# EAGLE design MotoraufsatzschSMD (EAGLE 4.16)
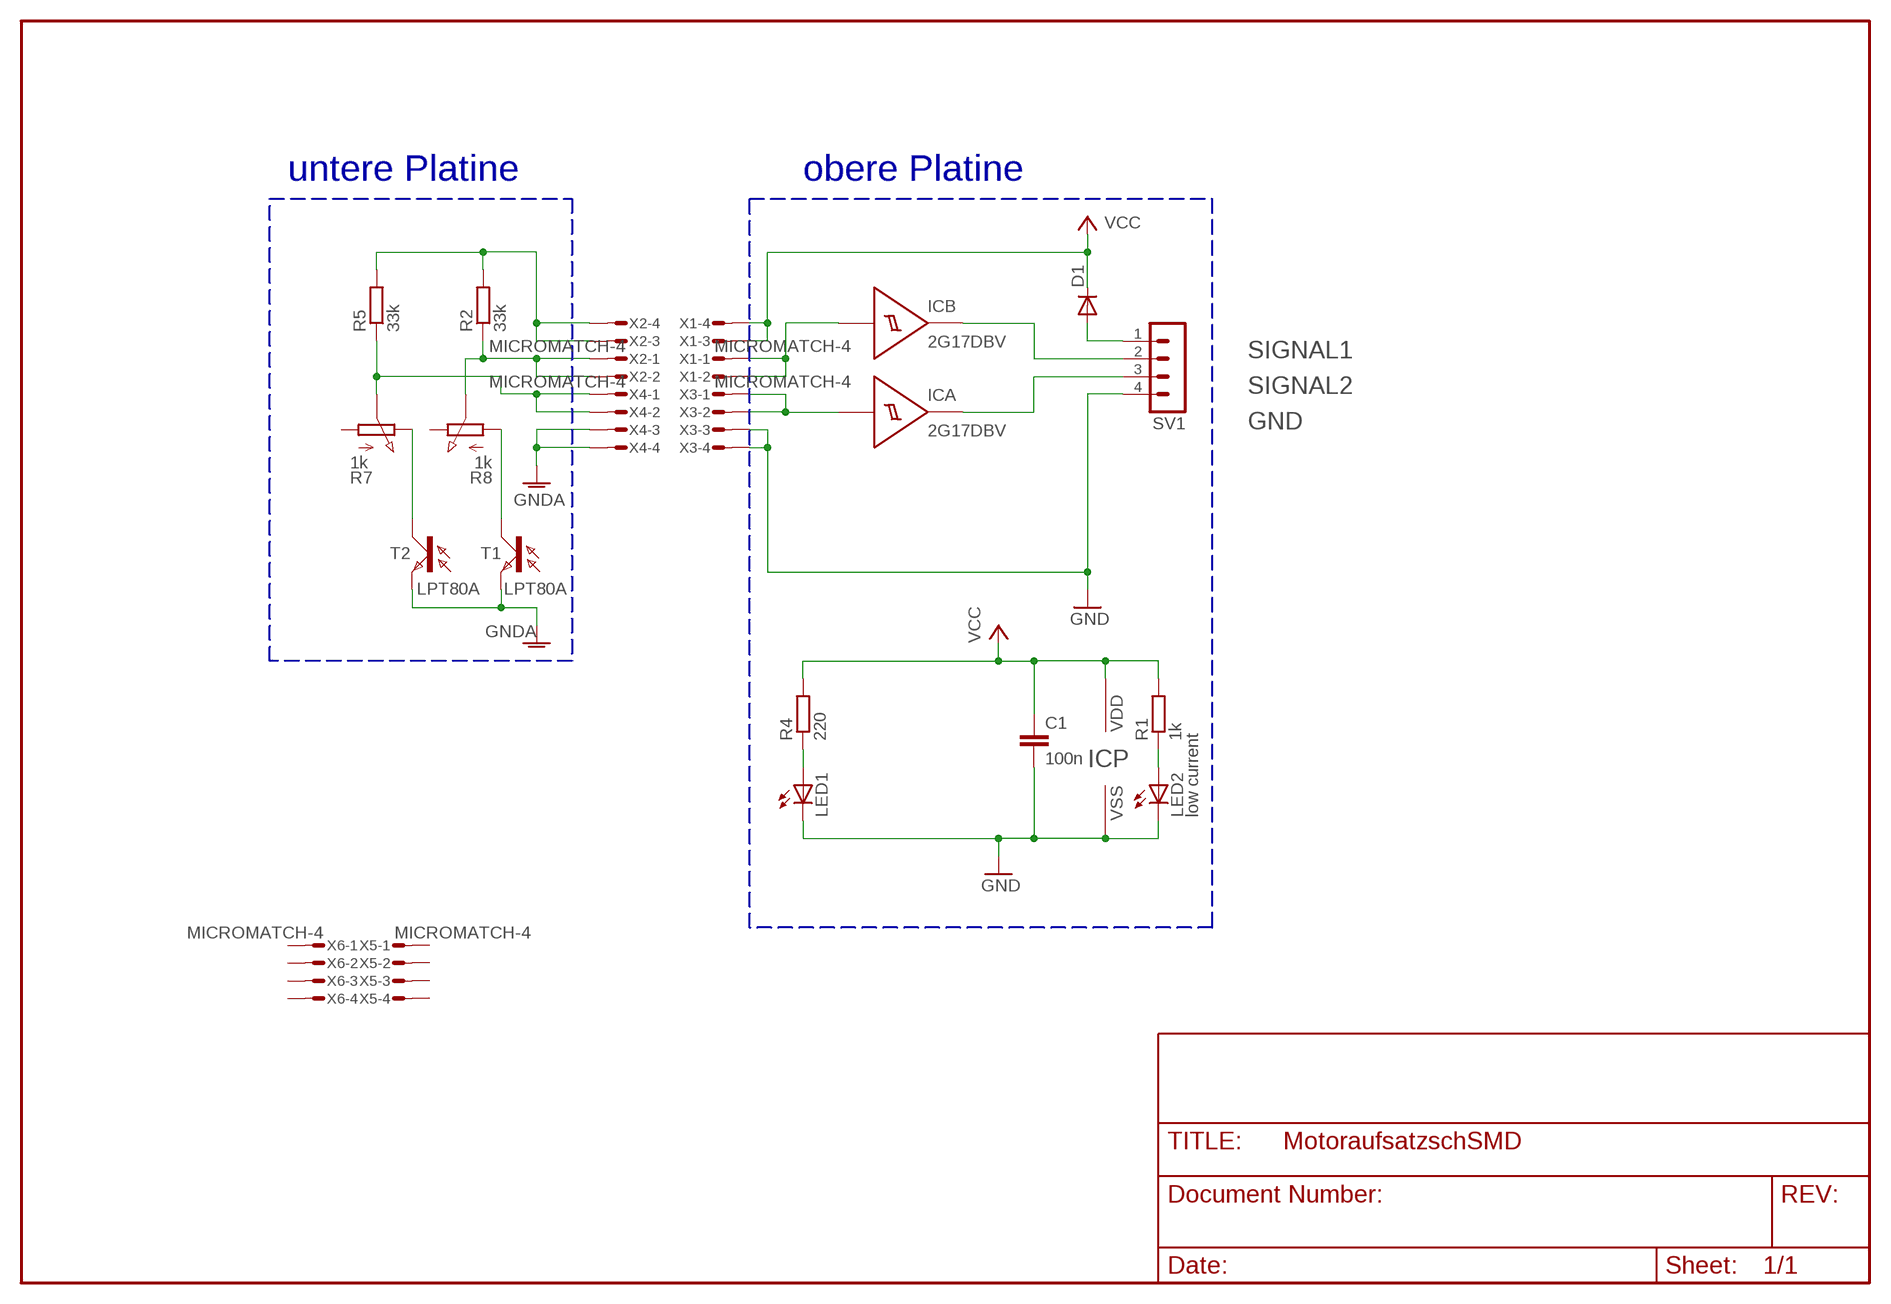
[diagram p0: schematic, sheet 1]

## Parts
C1  100n  C-EUC1206K  [C1206K]
D1  DIODE-MINIMELF  [MINIMELF]
IC  2G17DBV  [SOT23-6]
LED1  LEDIRL80A  [IRL80A]
LED2  low current  LEDSMT1206  [1206]
R1  1k  R-EU_M1206  [M1206]
R2  33k  R-EU_M1206  [M1206]
R4  220  R-EU_M1206  [M1206]
R5  33k  R-EU_M1206  [M1206]
R7  1k  PC25  [PC25]
R8  1k  PC25  [PC25]
SV1  MA04-1  [MA04-1]
T1  LPT80A  [LPT80A]
T2  LPT80A  [LPT80A]
X1  MICROMATCH-4  [MICROMATCH-4]
X2  MICROMATCH-4  [MICROMATCH-4]
X3  MICROMATCH-4  [MICROMATCH-4]
X4  MICROMATCH-4  [MICROMATCH-4]
X5  MICROMATCH-4  [MICROMATCH-4]
X6  MICROMATCH-4  [MICROMATCH-4]

## Nets
GND: C1.2 IC.5(P:VSS) LED1.K(C) LED2.C SV1.4 X3.3 X3.4
GNDA: T1.E T2.E X4.3 X4.4
N$1: IC.3(B:A) X1.1 X1.2
N$2: R8.A T1.C
N$3: IC.1(A:A) X3.1 X3.2
N$4: R7.E T2.C
N$5: LED2.A R1.1
N$6: LED1.A R4.1
N$7: R2.1 R8.S X2.1 X2.2
N$8: R5.1 R7.S X4.1 X4.2
N$9: D1.A SV1.1
N$10: R2.2 R5.2 X2.3 X2.4
SIGNAL1: IC.4(B:Q) SV1.2
SIGNAL2: IC.6(A:Q) SV1.3
VCC: C1.1 D1.C IC.2(P:VDD) R1.2 R4.2 X1.3 X1.4
Unconnected: R7.A R8.E X5.1 X5.2 X5.3 X5.4 X6.1 X6.2 X6.3 X6.4

## Buses
B$1
B$2

## Notes on the sheet
- untere Platine | obere Platine

## Library data of the parts
C1 = rcl:C-EU: CAPACITOR, European symbol
D1 = diode:DIODE-: DIODE
IC = little-logic:2G17: 2 Non-inverting buffer with schmitt-trigger input
LED1 LED2 = led:LED: LED OSRAM: - CHIPLED LG R971, LG N971, LY N971, LG Q971, LY Q971, LO R971, LY R971 LH N974, LH R974 LS Q976, LO Q976, LY Q976 LO Q996 - Hyper CHIPLED LW Q18S LB Q993, LB Q99A, LB R99A - SideLED LS A670, LO A670, LY A670, LG A670, LP A670 LB A673, LV A673, LT A673, LW A673 LH A674 LY A675 LS A676, LA A676, LO A676, LY A676, LW A676 LS A679, LY A679, LG A679 - Hyper Micro SIDELED® LS Y876, LA Y876, LO Y876, LY Y876 LT Y87S - SmartLED LW L88C, LW L88S LB L89C, LB L89S, LG L890 LS L89K, LO L89K, LY L89K LS L896, LA L896, LO L896, LY L896 - TOPLED LS T670, LO T670, LY T670, LG T670, LP T670 LSG T670, LSP T670, LSY T670, LOP T670, LYG T670 LG T671, LOG T671, LSG T671 LB T673, LV T673, LT T673, LW T673 LH T674 LS T676, LA T676, LO T676, LY T676, LB T676, LH T676, LSB T676, LW T676 LB T67C, LV T67C, LT T67C, LS T67K, LO T67K, LY T67K, LW E67C LS E67B, LA E67B, LO E67B, LY E67B, LB E67C, LV E67C, LT E67C LW T67C LS T679, LY T679, LG T679 LS T770, LO T770, LY T770, LG T770, LP T770 LB T773, LV T773, LT T773, LW T773 LH T774 LS E675, LA E675, LY E675, LS T675 LS T776, LA T776, LO T776, LY T776, LB T776 LHGB T686 LT T68C, LB T68C - Hyper Mini TOPLED® LB M676 - Mini TOPLED Santana® LG M470 LS M47K, LO M47K, LY M47K Source: http://www.osram.convergy.de/
R1 R2 R4 R5 = rcl:R-EU_: RESISTOR, European symbol
R7 R8 = pot-vitrohm:PC25: VITROHM POTENTIOMETER
SV1 = con-lstb:MA04-1: PIN HEADER
T1 T2 = opto-trans-siemens:LPT80A: PHOTO TRANSISTOR
X1-X6 = con-amp-micromatch:MICROMATCH-4: MicroMaTch 4 7-215464-4 / 0-215464-4 Drawing Number C-215464 DDEController.pdf

## Board
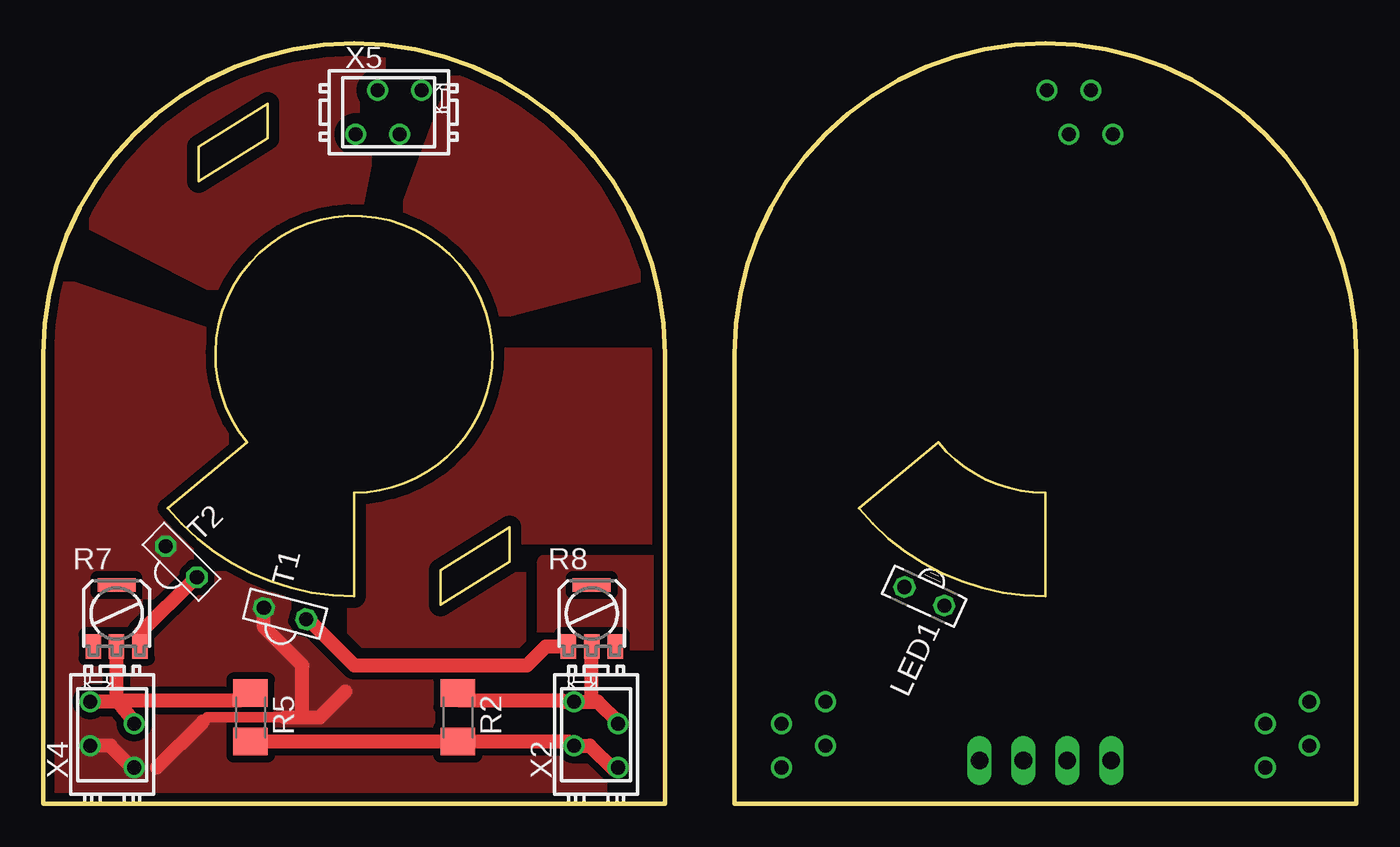
[diagram p1: board, top side]
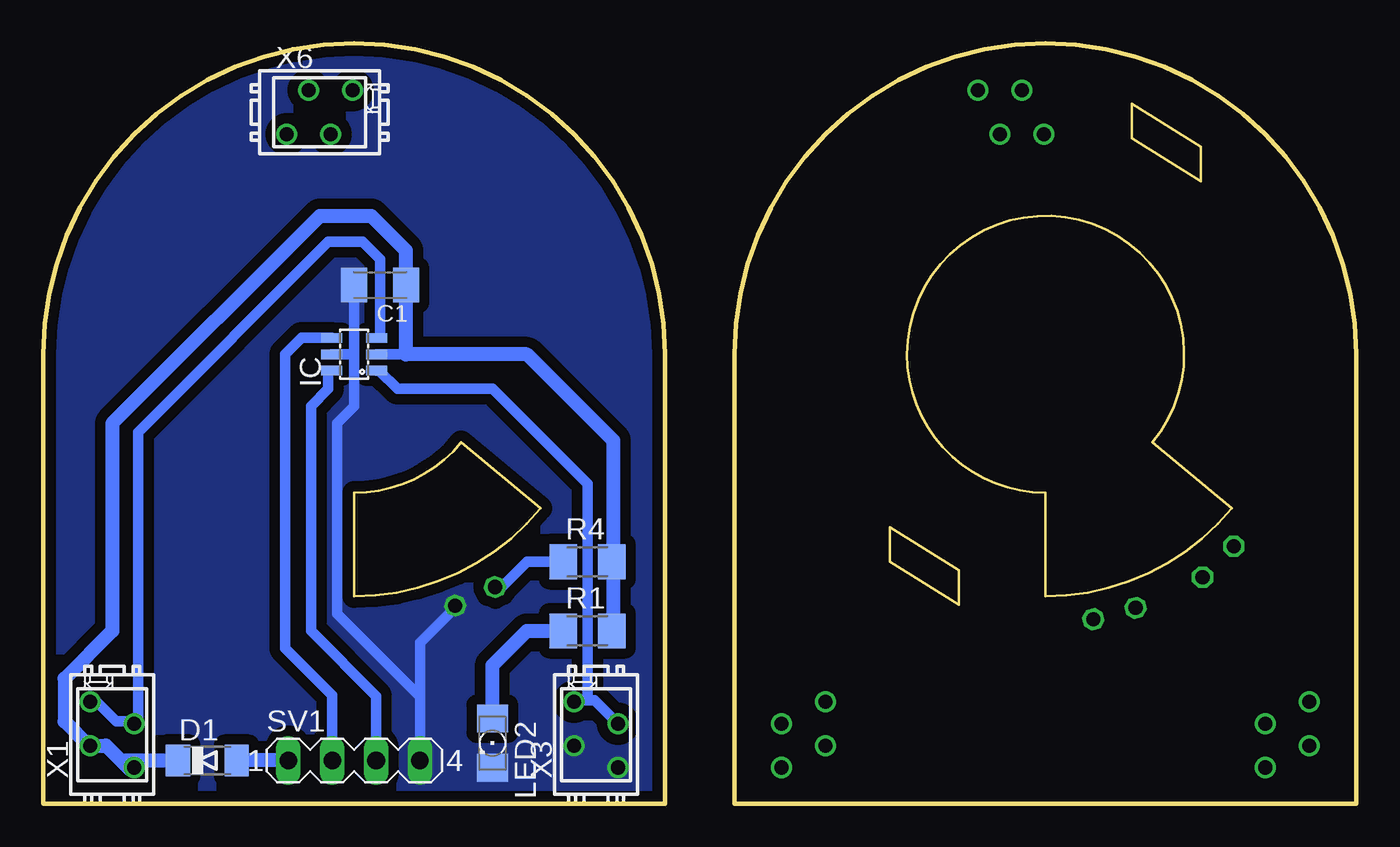
[diagram p2: board, bottom side, seen from below]

Size 76 x 44 mm. Coordinates in mm from the lower left corner, seen from the top.
Outline: 0,26 arc-180 36,26 36,0 0,0 0,26
Outline: 13,38.5 13,40.5 9,38 9,36 13,38.5
Outline: 27,14 23,11.5 23,13.5 27,16 27,14
Outline: 26,26 arc-90 18,18 18,12 arc-50 7.2,17.1 11.8,20.9 arc-220 26,26
Outline: 40,26 arc-180 76,26 76,0 40,0 40,26
Outline: 58,12 58,18 arc-51 51.8,20.9 47.2,17.1 arc50 58,12
Copper layers (1*16): Top 0.035mm / dielectric 1.5mm / Bottom 0.035mm
Design rules "olaf": minimum track width 16mil, minimum drill 12mil, track to track 10mil, track to pad 10mil, pad to pad 8mil, via to via 8mil, smd to smd 8mil, copper to edge 20mil, drill to drill 8mil, minimum pad ring 8mil, minimum via ring 6mil, stop-mask expansion 3mil, vias tented up to drill 0mil, thermal gap 8mil
bKeepout: area 63,11.5 to 67,16; area 49,36 to 53,40.5

### Footprints (pad centres in the part's own frame; a part is rotated, then mirrored left to right if it is on the bottom)
C1206K = smd 1.5 x 2: 1 -1.5,0; 2 1.5,0
MINIMELF = smd 1.4 x 1.8: A 1.7,0; C -1.7,0
SOT23-6 = smd 0.55 x 1.2: 1 -0.95,-1.3; 2 0,-1.3; 3 0.95,-1.3; 4 0.95,1.3; 5 0,1.3; 6 -0.95,1.3
IRL80A = drill 0.813 octagon: A 0,-1.27; K 0,1.27
1206 = smd 1.6 x 1.803: A -1.422,0; C 1.422,0
M1206 = smd 1.6 x 2: 1 -1.4,0; 2 1.4,0
PC25 = smd 2.2 x 0.8: 4 0,1.65 | smd 0.9 x 1.4: A -1.35,-1.9; E 1.35,-1.9; S 0,-1.9
MA04-1 = drill 1.016 long: 1 -3.81,0; 2 -1.27,0; 3 1.27,0; 4 3.81,0
LPT80A = drill 0.813 octagon: C 0,-1.27; E 0,1.27
MICROMATCH-4 = drill 0.813 round: 1 1.905,1.27; 2 0.635,-1.27; 3 -0.635,1.27; 4 -1.905,-1.27

### Placement (x,y rotation side)
C1  56.5,30 180 bottom
D1  66.5,2.5 0 bottom
IC  58,26 90 bottom
LED1  51,12 245 top
LED2  50,3.5 270 bottom
R1  44.5,10 0 bottom
R2  24,5 270 top
R4  44.5,14 0 bottom
R5  12,5 270 top
R7  4.25,11 0 top
R8  31.75,11 0 top
SV1  58,2.5 0 bottom
T1  14,11 75 top
T2  8,14 45 top
X1  72,4 90 bottom
X2  32,4 90 top
X3  44,4 90 bottom
X4  4,4 90 top
X5  20,40 0 top
X6  60,40 0 bottom

### Tracks (layer width: path | path; a pad name or v marks a point on that pad's centre or on a via)
GND
  Bottom 0.61: SV1.4 54.19,6.19 | 54.19,6.19 59,11 59,22 58,23 58,26 | 58,26 IC.5 | 52.04,11.46 52,11.5 | 52.04,11.46 LED1.K | 54.19,6.19 54.19,9.31 52.04,11.46 | 58,26 C1.2
  pour Bottom (isolate 0.61, rank 3, no thermals): 40,0 76,0 76,44 40,44
GNDA
  Top 0.61: 9.25,4.75 9.5,5 14,5
  Top 0.813: X4.4 5.27,2.02 5.25,2 3.88,3.37 X4.3 | 6.59,2.1 9.25,4.75 | 14,5 15,5 | 15,5 16,5 17.5,6.5 | T1.E 12.77,10.23 15,8 15,5
  pour Top (isolate 0.406, no thermals): 0,0 0,28 0.5,30.25 10,27 10.25,24 11,22.25 11.75,21 7.25,17.25 10,14.5 14,12.5 18,12 18,9.25 36,9.25 36,0
  pour Top (isolate 0.406, no thermals): 29,9.25 29,14 36,14 36,9.25
MOTORA
  pour Top (isolate 0.61, rank 5): 25.75,26 36,26 36,9 18,9 18,18 22,19 25,22
N$1
  Bottom 0.61: IC.3 56.55,26.95 56.5,27 56.5,31.5 57.5,32.5 59.5,32.5 70.5,21.5 70.5,5 70.73,4.77 | X1.2 70.73,4.77 | X1.1 73.09,5.91 73,6 71.77,4.77 70.73,4.77
N$2
  Top 0.813: R8.A 29.1,9.1 28,8 18,8 15.25,10.75 15.23,10.73 T1.C
N$3
  Bottom 0.61: X3.2 44.09,6 44.5,6 | X3.1 45.17,6 44.5,6 | 44.5,6 44.5,18.5 50,24 55.5,24 56.55,25.05 IC.1
N$4
  Top 0.813: T2.C 8.85,13.1 5.6,9.85 R7.E
N$5
  Bottom 0.813: R1.1 48,10 50,8 LED2.A
N$6
  Bottom 0.61: LED1.A 49.54,12.54 49.5,12.5 48,14 R4.1
N$7
  Top 0.813: R2.1 24,6 30,6 30.09,5.91 X2.1 31.75,5.91 | X2.2 33.27,4.73 32.09,5.91 31.75,5.91 | 31.75,5.91 R8.S
N$8
  Top 0.813: X4.2 5.27,4.73 4.25,6 | X4.1 4.16,5.91 4.25,6 | R5.1 12,6.5 11.5,6 4.25,6 | 4.25,6 R7.S
N$9
  Bottom 0.813: 64.5,2.5 D1.A SV1.1
N$10
  Top 0.813: X2.4 33.09,2.1 33,2 31.64,3.37 X2.3 30.64,3.37 30.4,3.6 R2.2 12.1,3.6 12,3.5 R5.2
N$11
  pour Top (isolate 0.61, rank 3): 2,34 6,40 10,42 14,44 20,44 18,34 14,33 10.75,29.5
N$14
  pour Top (isolate 0.61, rank 3): 20.75,33.5 24.25,43 28,41 31.5,38 34,34 35.25,30.75 25.75,28.25 24,31.25
SIGNAL1
  Bottom 0.61: SV1.2 59.27,6.27 62,9 62,26 61.05,26.95 IC.4
SIGNAL2
  Bottom 0.61: SV1.3 56.73,6.23 60.5,10 60.5,23 59.5,24 59.5,25 59.45,25.05 IC.6
VCC
  Bottom 0.61: 55,26 IC.2
  Bottom 0.813: 43,14 43,21 48,26 55,26 C1.1 55,32 57,34 60,34 72,22 72,10 74.76,7.24 74.76,4.76 73.36,3.37 X1.3 72.36,3.37 71.5,2.5 | 43,14 R4.2 | R1.2 43,10 43,14 | X1.4 70.91,2.1 71,2 71.5,2.5 | 71.5,2.5 D1.C